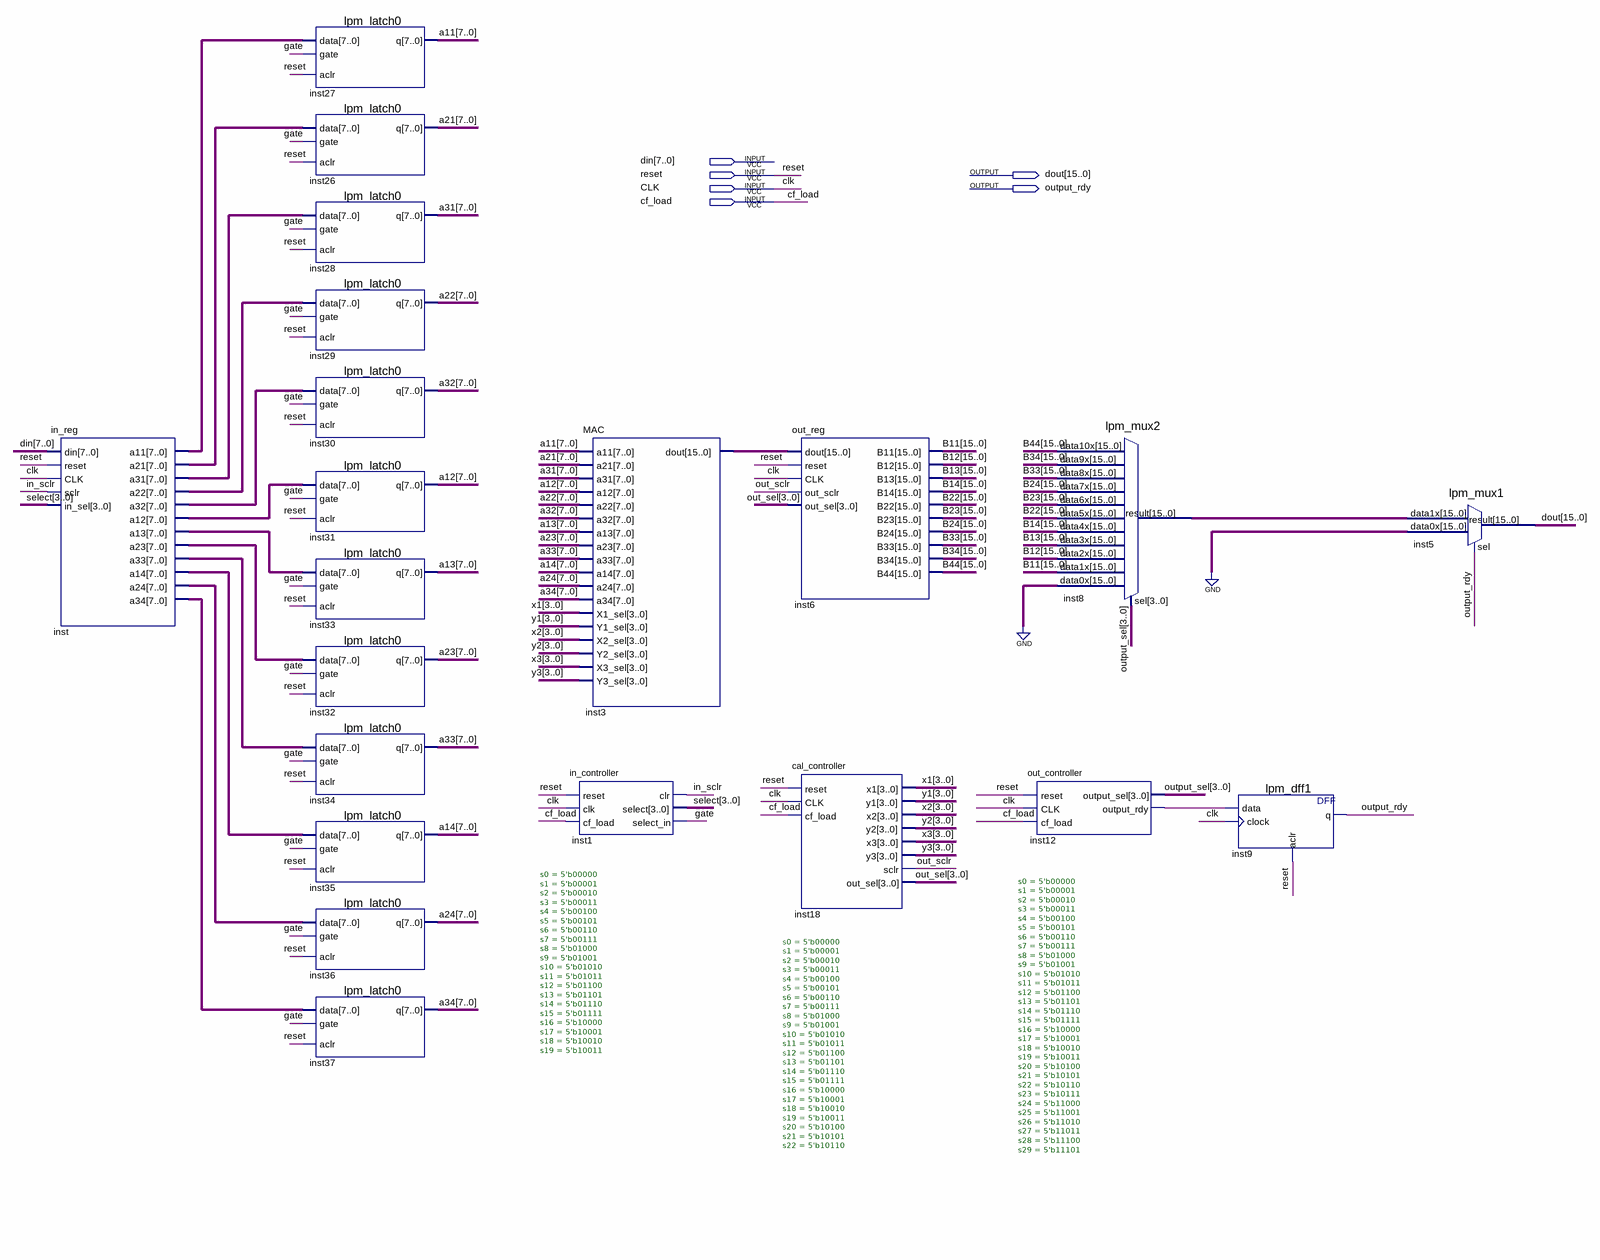
[diagram p0: schematic sheet]
// Quartus schematic newfinal.bdf as structural Verilog: 21 symbols, 6 pins
module newfinal (
  input  [7:0] din,
  input  reset,
  input  CLK,
  input  cf_load,
  output [15:0] dout,
  output output_rdy
);

  wire gate, in_sclr, inst12_output_rdy, out_sclr;
  wire [3:0] out_sel, output_sel, select, x1, x2, x3, y1, y2, y3;
  wire [7:0] a11, a12, a13, a14, a21, a22, a23, a24, a31, a32, a33, a34, inst_a11, inst_a12, inst_a13,
       inst_a14, inst_a21, inst_a22, inst_a23, inst_a24, inst_a31, inst_a32, inst_a33, inst_a34;
  wire [15:0] B11, B12, B13, B14, B22, B23, B24, B33, B34, B44, inst3_dout, inst8_result;

  in_reg inst (
    .din(din), .reset(reset), .CLK(CLK), .sclr(in_sclr), .in_sel(select), .a11(inst_a11), .a21(inst_a21),
    .a31(inst_a31), .a22(inst_a22), .a32(inst_a32), .a12(inst_a12), .a13(inst_a13), .a23(inst_a23),
    .a33(inst_a33), .a14(inst_a14), .a24(inst_a24), .a34(inst_a34));
  lpm_latch0 inst27 (.data(inst_a11), .gate(gate), .aclr(reset), .q(a11));
  lpm_latch0 inst26 (.data(inst_a21), .gate(gate), .aclr(reset), .q(a21));
  lpm_latch0 inst28 (.data(inst_a31), .gate(gate), .aclr(reset), .q(a31));
  lpm_latch0 inst29 (.data(inst_a22), .gate(gate), .aclr(reset), .q(a22));
  lpm_latch0 inst30 (.data(inst_a32), .gate(gate), .aclr(reset), .q(a32));
  lpm_latch0 inst31 (.data(inst_a12), .gate(gate), .aclr(reset), .q(a12));
  lpm_latch0 inst33 (.data(inst_a13), .gate(gate), .aclr(reset), .q(a13));
  lpm_latch0 inst32 (.data(inst_a23), .gate(gate), .aclr(reset), .q(a23));
  lpm_latch0 inst34 (.data(inst_a33), .gate(gate), .aclr(reset), .q(a33));
  lpm_latch0 inst35 (.data(inst_a14), .gate(gate), .aclr(reset), .q(a14));
  lpm_latch0 inst36 (.data(inst_a24), .gate(gate), .aclr(reset), .q(a24));
  lpm_latch0 inst37 (.data(inst_a34), .gate(gate), .aclr(reset), .q(a34));
  MAC inst3 (
    .a11(a11), .a21(a21), .a31(a31), .a12(a12), .a22(a22), .a32(a32), .a13(a13), .a23(a23), .a33(a33),
    .a14(a14), .a24(a24), .a34(a34), .X1_sel(x1), .Y1_sel(y1), .X2_sel(x2), .Y2_sel(y2), .X3_sel(x3),
    .Y3_sel(y3), .dout(inst3_dout));
  in_controller #(.s0(5'b00000), .s1(5'b00001), .s2(5'b00010), .s3(5'b00011), .s4(5'b00100), .s5(5'b00101), .s6(5'b00110), .s7(5'b00111), .s8(5'b01000), .s9(5'b01001), .s10(5'b01010), .s11(5'b01011), .s12(5'b01100), .s13(5'b01101), .s14(5'b01110), .s15(5'b01111), .s16(5'b10000), .s17(5'b10001), .s18(5'b10010), .s19(5'b10011)) inst1 (
    .reset(reset), .clk(CLK), .cf_load(cf_load), .clr(in_sclr), .select(select), .select_in(gate));
  out_reg inst6 (
    .dout(inst3_dout), .reset(reset), .CLK(CLK), .out_sclr(out_sclr), .out_sel(out_sel), .B11(B11),
    .B12(B12), .B13(B13), .B14(B14), .B22(B22), .B23(B23), .B24(B24), .B33(B33), .B34(B34), .B44(B44));
  cal_controller #(.s0(5'b00000), .s1(5'b00001), .s2(5'b00010), .s3(5'b00011), .s4(5'b00100), .s5(5'b00101), .s6(5'b00110), .s7(5'b00111), .s8(5'b01000), .s9(5'b01001), .s10(5'b01010), .s11(5'b01011), .s12(5'b01100), .s13(5'b01101), .s14(5'b01110), .s15(5'b01111), .s16(5'b10000), .s17(5'b10001), .s18(5'b10010), .s19(5'b10011), .s20(5'b10100), .s21(5'b10101), .s22(5'b10110)) inst18 (
    .reset(reset), .CLK(CLK), .cf_load(cf_load), .x1(x1), .y1(y1), .x2(x2), .y2(y2), .x3(x3), .y3(y3),
    .sclr(out_sclr), .out_sel(out_sel));
  lpm_mux2 inst8 (
    .data10x(B44), .data9x(B34), .data8x(B33), .data7x(B24), .data6x(B23), .data5x(B22), .data4x(B14),
    .data3x(B13), .data2x(B12), .data1x(B11), .data0x({16{1'b0}}), .sel(output_sel), .result(inst8_result));
  out_controller #(.s0(5'b00000), .s1(5'b00001), .s2(5'b00010), .s3(5'b00011), .s4(5'b00100), .s5(5'b00101), .s6(5'b00110), .s7(5'b00111), .s8(5'b01000), .s9(5'b01001), .s10(5'b01010), .s11(5'b01011), .s12(5'b01100), .s13(5'b01101), .s14(5'b01110), .s15(5'b01111), .s16(5'b10000), .s17(5'b10001), .s18(5'b10010), .s19(5'b10011), .s20(5'b10100), .s21(5'b10101), .s22(5'b10110), .s23(5'b10111), .s24(5'b11000), .s25(5'b11001), .s26(5'b11010), .s27(5'b11011), .s28(5'b11100), .s29(5'b11101)) inst12 (
    .reset(reset), .CLK(CLK), .cf_load(cf_load), .output_sel(output_sel), .output_rdy(inst12_output_rdy));
  lpm_dff1 inst9 (.data(inst12_output_rdy), .clock(CLK), .aclr(reset), .q(output_rdy));
  lpm_mux1 inst5 (.data1x(inst8_result), .data0x({16{1'b0}}), .sel(output_rdy), .result(dout));
endmodule
